# EAGLE schematic ALU Flags (EAGLE 9.6.2)
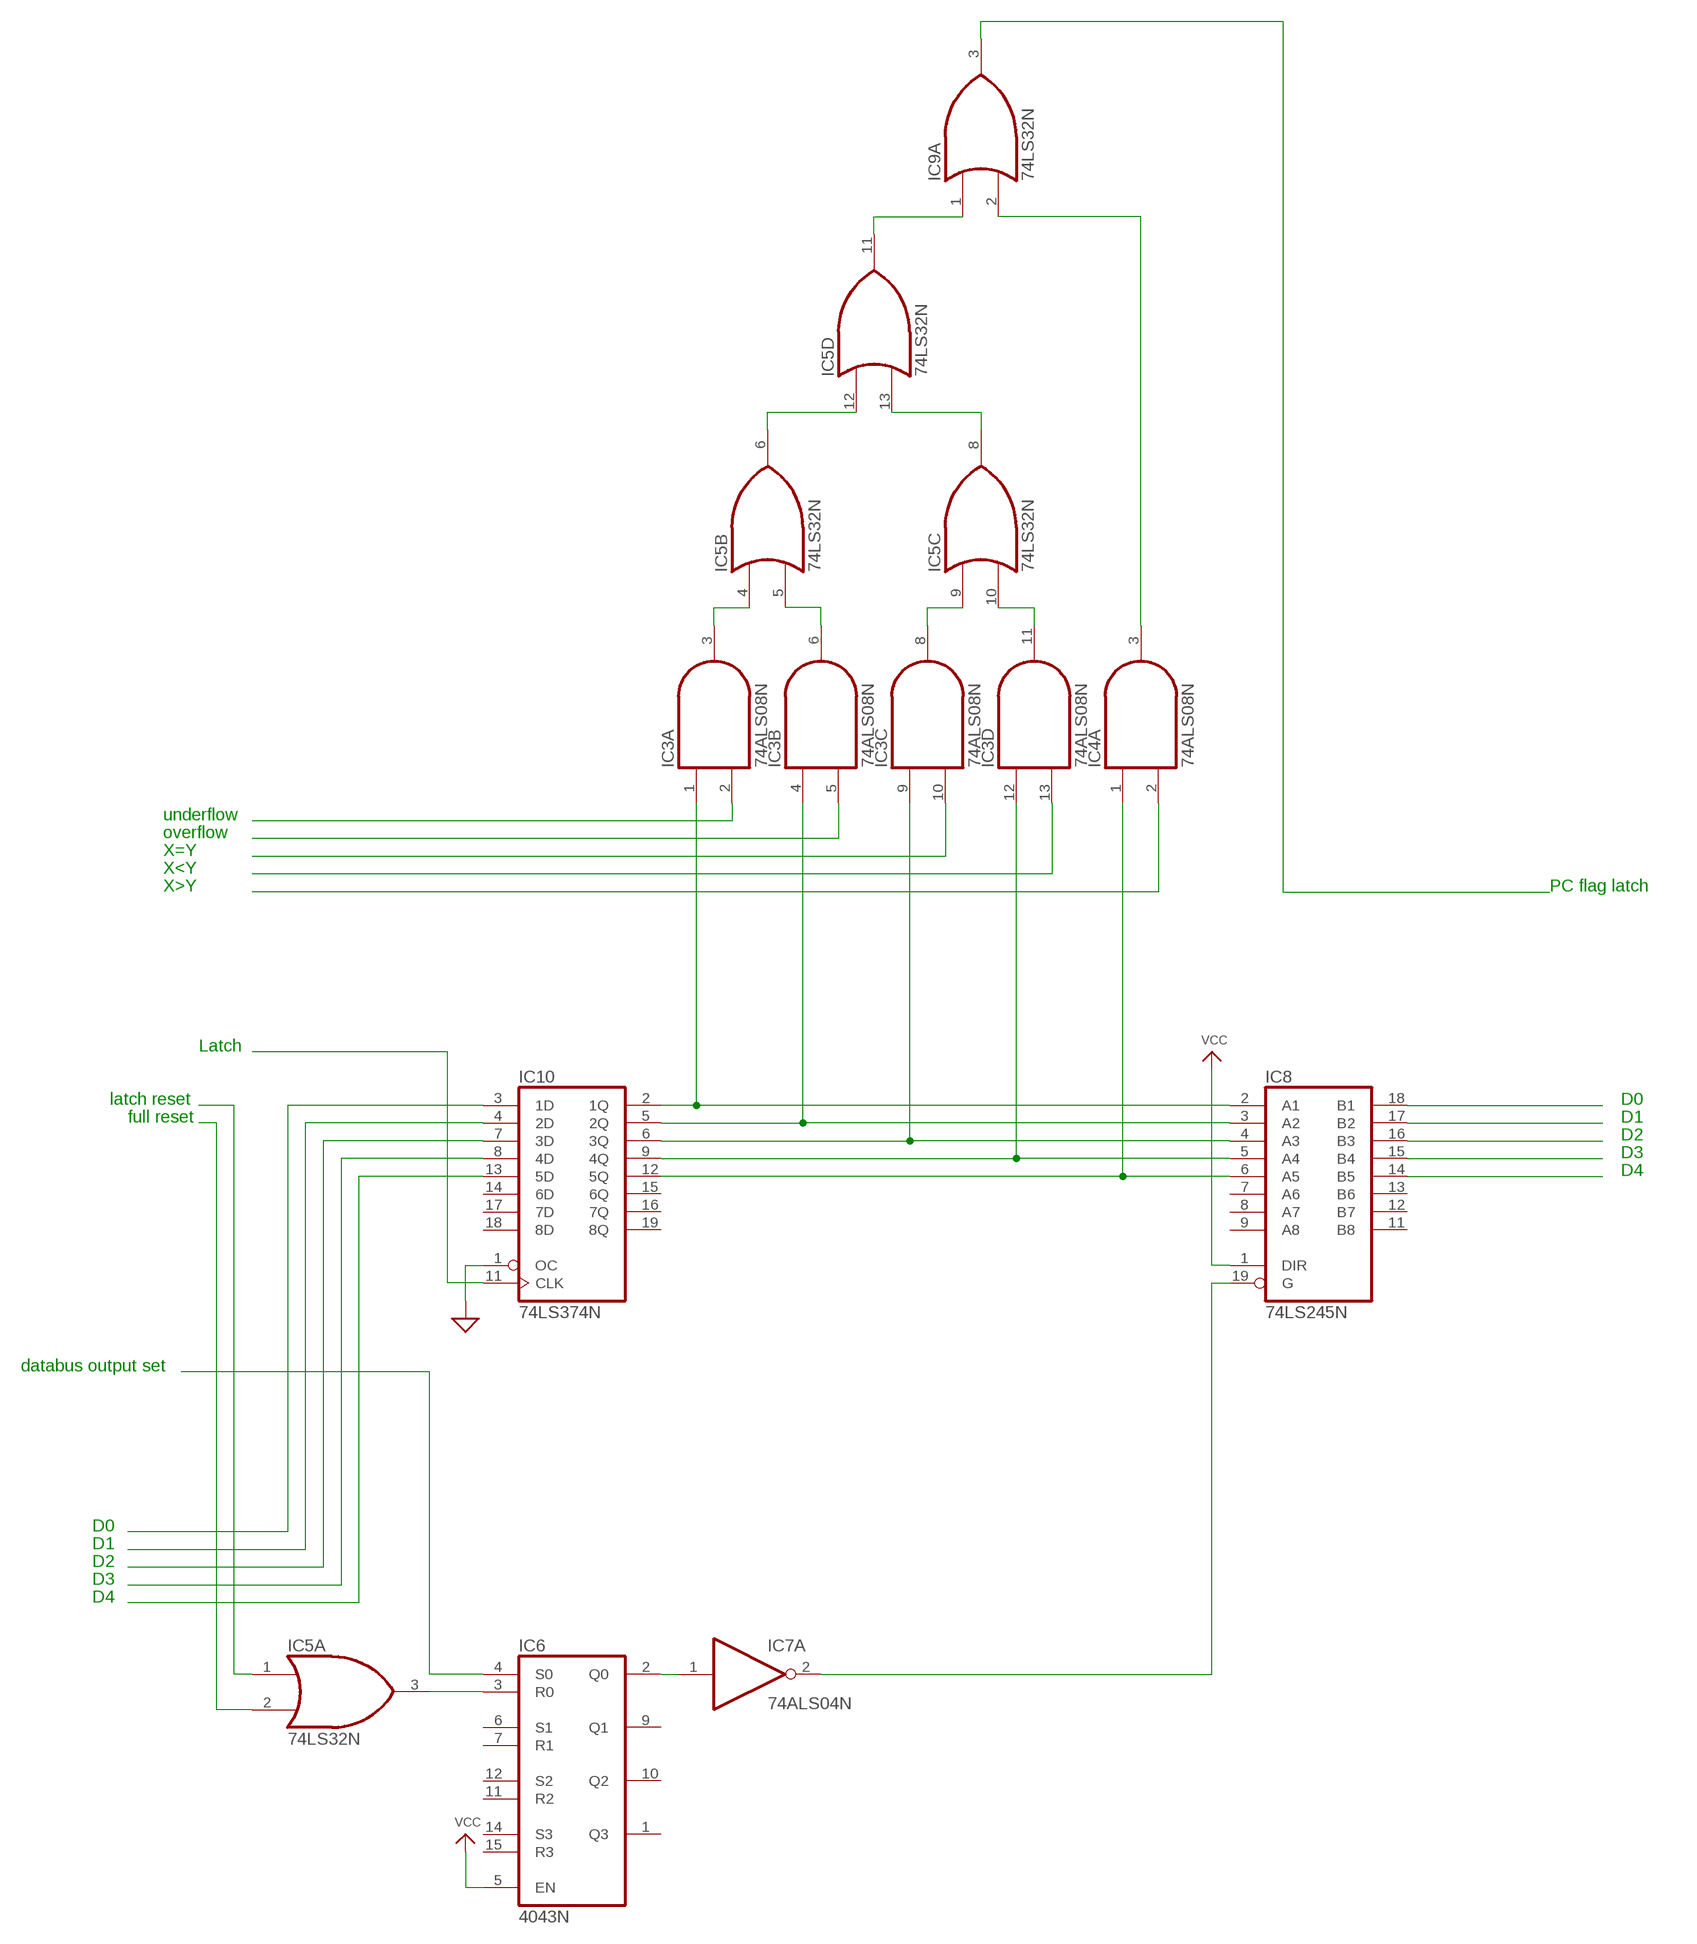
[diagram p0: schematic, sheet 1]

## Parts
IC3  74ALS08N  [DIL14]
IC4  74ALS08N  [DIL14]
IC5  74LS32N  [DIL14]
IC6  4043N  [DIL16]
IC7  74ALS04N  [DIL14]
IC8  74LS245N  [DIL20]
IC9  74LS32N  [DIL14]
IC10  74LS374N  [DIL20]

## Nets
GND: IC10.1(OC) ; supply symbol labelled SUP
N$1: IC10.3(1D)
N$2: IC10.4(2D)
N$4: IC10.7(3D)
N$5: IC10.8(4D)
N$6: IC10.13(5D)
N$7: IC3.1(A:I0) IC8.2(A1) IC10.2(1Q)
N$8: IC3.4(B:I0) IC8.3(A2) IC10.5(2Q)
N$9: IC3.9(C:I0) IC8.4(A3) IC10.6(3Q)
N$10: IC3.12(D:I0) IC8.5(A4) IC10.9(4Q)
N$11: IC4.1(A:I0) IC8.6(A5) IC10.12(5Q)
N$12: IC3.2(A:I1)
N$13: IC3.5(B:I1)
N$14: IC3.10(C:I1)
N$15: IC3.13(D:I1)
N$16: IC4.2(A:I1)
N$17: IC5.3(A:O) IC6.3(R0)
N$18: IC5.1(A:I0)
N$19: IC5.2(A:I1)
N$20: IC6.4(S0)
N$21: IC6.2(Q0) IC7.1(A:I)
N$22: IC7.2(A:O) IC8.19(G)
N$23: IC3.3(A:O) IC5.4(B:I0)
N$24: IC8.18(B1)
N$25: IC8.17(B2)
N$26: IC8.16(B3)
N$27: IC8.15(B4)
N$28: IC8.14(B5)
N$29: IC3.6(B:O) IC5.5(B:I1)
N$30: IC3.8(C:O) IC5.9(C:I0)
N$31: IC3.11(D:O) IC5.10(C:I1)
N$32: IC5.6(B:O) IC5.12(D:I0)
N$33: IC5.8(C:O) IC5.13(D:I1)
N$34: IC5.11(D:O) IC9.1(A:I0)
N$35: IC4.3(A:O) IC9.2(A:I1)
N$36: IC9.3(A:O)
N$37: IC10.11(CLK)
VCC: IC6.5(EN) IC8.1(DIR)
Unconnected: IC4.4(B:I0) IC4.5(B:I1) IC4.6(B:O) IC4.8(C:O) IC4.9(C:I0) IC4.10(C:I1) IC4.11(D:O) IC4.12(D:I0) IC4.13(D:I1) IC6.1(Q3) IC6.6(S1) IC6.7(R1) IC6.9(Q1) IC6.10(Q2) IC6.11(R2) IC6.12(S2) IC6.14(S3) IC6.15(R3) IC7.3(B:I) IC7.4(B:O) IC7.5(C:I) IC7.6(C:O) IC7.8(D:O) IC7.9(D:I) IC7.10(E:O) IC7.11(E:I) IC7.12(F:O) IC7.13(F:I) IC8.7(A6) IC8.8(A7) IC8.9(A8) IC8.11(B8) IC8.12(B7) IC8.13(B6) IC9.4(B:I0) IC9.5(B:I1) IC9.6(B:O) IC9.8(C:O) IC9.9(C:I0) IC9.10(C:I1) IC9.11(D:O) IC9.12(D:I0) IC9.13(D:I1) IC10.14(6D) IC10.15(6Q) IC10.16(7Q) IC10.17(7D) IC10.18(8D) IC10.19(8Q)

## Notes on the sheet
- underflow
- overflow
- X=Y
- X<Y
- X>Y | PC flag latch
- Latch
- latch reset | D0
- full reset | D1
- D2
- D3
- D4
- databus output set
- D0
- D1
- D2
- D3
- D4

## Power pins joined to a net without a drawn wire
GND: IC3.7(P:GND) IC4.7(P:GND) IC5.7(P:GND) IC7.7(P:GND) IC8.10(GND) IC9.7(P:GND) IC10.10(GND)
VCC: IC3.14(P:VCC) IC4.14(P:VCC) IC5.14(P:VCC) IC7.14(P:VCC) IC8.20(VCC) IC9.14(P:VCC) IC10.20(VCC)
VDD: IC6.16(VDD)
VSS: IC6.8(VSS)

## Library data of the parts
IC3 IC4 = 74xx-us:74*08: Quad 2-input AND gate
IC5 IC9 = 74xx-us:74*32: Quad 2-input OR gate
IC6 = 40xx:4043: Quad 3-state NOR R/S LATCH
IC7 = 74xx-us:74*04: Hex INVERTER
IC8 = 74xx-us:74*245: Octal BUS TRANSCEIVER, 3-state
IC10 = 74xx-us:74*374: Octal D type transparent LATCH, edge triggered